# EAGLE design SkyNetV3.1 (EAGLE 7.2.0)

## Sheet 1 of 4: Controller
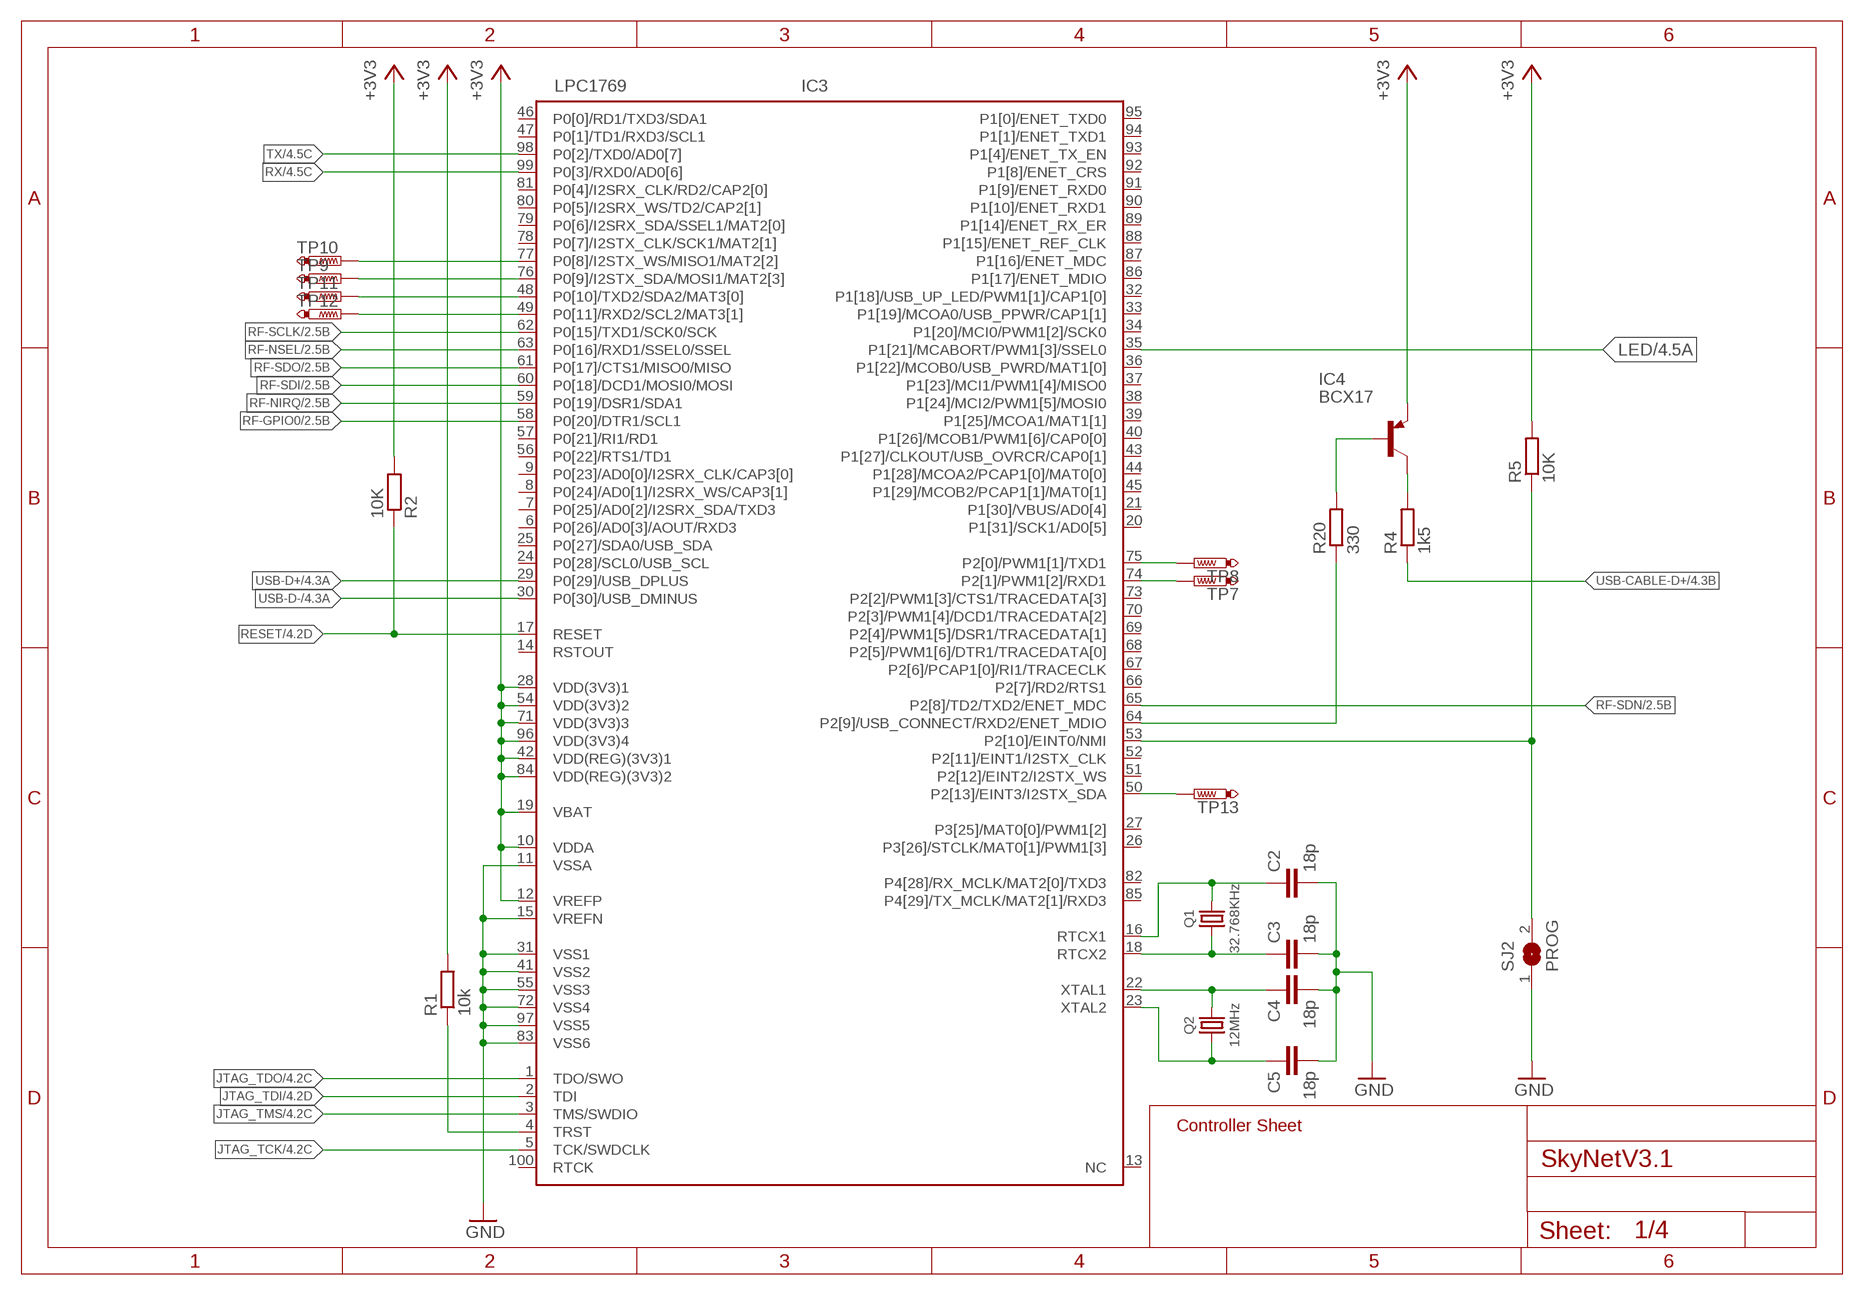
[diagram p0: schematic, sheet 1]

### Parts
C2  18p  C-EUC0603  [C0603]
C3  18p  C-EUC0603  [C0603]
C4  18p  C-EUC0603  [C0603]
C5  18p  C-EUC0603  [C0603]
IC3  LPC1769  LPC1768  [LQFP100-14X14]
IC4  BCX17  [SOT23]
Q1  32.768KHz  XTAL2-PAD  [XTAL_49_18]
Q2  12MHz  XTAL4-PAD  [XTAL_50_32]
R1  10k  R-EU_R0603  [R0603]
R2  10K  R-EU_R0603  [R0603]
R4  1k5  R-EU_R0603  [R0603]
R5  10K  R-EU_R0603  [R0603]
R20  330  R-EU_R0603  [R0603]
SJ2  PROG  SJ  [SJ]
TP7  PTR1B1,27  [B1,27]
TP8  PTR1B1,27  [B1,27]
TP9  PTR1B1,27  [B1,27]
TP10  PTR1B1,27  [B1,27]
TP11  PTR1B1,27  [B1,27]
TP12  PTR1B1,27  [B1,27]
TP13  PTR1B1,27  [B1,27]

### Nets
+3V3: IC3.10(VDDA) IC3.12(VREFP) IC3.19(VBAT) IC3.28(VDD(3V3)1) IC3.42(VDD(REG)(3V3)1) IC3.54(VDD(3V3)2) IC3.71(VDD(3V3)3) IC3.84(VDD(REG)(3V3)2) IC3.96(VDD(3V3)4) IC4.2(E) R1.2 R2.2 R5.2 ; also sheet 2,3,4
GND: C2.2 C3.2 C4.2 C5.2 IC3.11(VSSA) IC3.15(VREFN) IC3.31(VSS1) IC3.41(VSS2) IC3.55(VSS3) IC3.72(VSS4) IC3.83(VSS6) IC3.97(VSS5) SJ2.1 ; also sheet 2,3,4
JTAG-TRST: IC3.4(TRST) R1.1
JTAG_TCK: IC3.5(TCK/SWDCLK) ; also sheet 4
JTAG_TDI: IC3.2(TDI) ; also sheet 4
JTAG_TDO: IC3.1(TDO/SWO) ; also sheet 4
JTAG_TMS: IC3.3(TMS/SWDIO) ; also sheet 4
LED: IC3.35(P1[21]/MCABORT/PWM1[3]/SSEL0) ; also sheet 4
N$3: IC3.75(P2[0]/PWM1[1]/TXD1) TP8.TP
N$5: IC3.76(P0[9]/I2STX_SDA/MOSI1/MAT2[3]) TP9.TP
N$6: IC3.77(P0[8]/I2STX_WS/MISO1/MAT2[2]) TP10.TP
N$7: IC3.74(P2[1]/PWM1[2]/RXD1) TP7.TP
N$8: IC3.49(P0[11]/RXD2/SCL2/MAT3[1]) TP12.TP
N$9: IC3.48(P0[10]/TXD2/SDA2/MAT3[0]) TP11.TP
N$10: IC3.50(P2[13]/EINT3/I2STX_SDA) TP13.TP
PROG: IC3.53(P2[10]/EINT0/NMI) R5.1 SJ2.2
RESET: IC3.17(RESET) R2.1 ; also sheet 4
RF-GPIO0: IC3.58(P0[20]/DTR1/SCL1) ; also sheet 2
RF-NIRQ: IC3.59(P0[19]/DSR1/SDA1) ; also sheet 2
RF-NSEL: IC3.63(P0[16]/RXD1/SSEL0/SSEL) ; also sheet 2
RF-SCLK: IC3.62(P0[15]/TXD1/SCK0/SCK) ; also sheet 2
RF-SDI: IC3.60(P0[18]/DCD1/MOSI0/MOSI) ; also sheet 2
RF-SDN: IC3.65(P2[8]/TD2/TXD2/ENET_MDC) ; also sheet 2
RF-SDO: IC3.61(P0[17]/CTS1/MISO0/MISO) ; also sheet 2
RTCX1: C2.1 IC3.16(RTCX1) Q1.2
RTCX2: C3.1 IC3.18(RTCX2) Q1.1
RX: IC3.99(P0[3]/RXD0/AD0[6]) ; also sheet 4
TX: IC3.98(P0[2]/TXD0/AD0[7]) ; also sheet 4
USB-CABLE-D+: R4.1 ; also sheet 4
USB-CON: IC3.64(P2[9]/USB_CONNECT/RXD2/ENET_MDIO) R20.1
USB-CON-TRANS: IC4.1(B) R20.2
USB-CON-TRANS-2: IC4.3(C) R4.2
USB-D+: IC3.29(P0[29]/USB_DPLUS) ; also sheet 4
USB-D-: IC3.30(P0[30]/USB_DMINUS) ; also sheet 4
XTAL1: C4.1 IC3.22(XTAL1) Q2.3
XTAL2: C5.1 IC3.23(XTAL2) Q2.1
Unconnected: IC3.6(P0[26]/AD0[3]/AOUT/RXD3) IC3.7(P0[25]/AD0[2]/I2SRX_SDA/TXD3) IC3.8(P0[24]/AD0[1]/I2SRX_WS/CAP3[1]) IC3.9(P0[23]/AD0[0]/I2SRX_CLK/CAP3[0]) IC3.13(NC) IC3.14(RSTOUT) IC3.20(P1[31]/SCK1/AD0[5]) IC3.21(P1[30]/VBUS/AD0[4]) IC3.24(P0[28]/SCL0/USB_SCL) IC3.25(P0[27]/SDA0/USB_SDA) IC3.26(P3[26]/STCLK/MAT0[1]/PWM1[3]) IC3.27(P3[25]/MAT0[0]/PWM1[2]) IC3.32(P1[18]/USB_UP_LED/PWM1[1]/CAP1[0]) IC3.33(P1[19]/MCOA0/USB_PPWR/CAP1[1]) IC3.34(P1[20]/MCI0/PWM1[2]/SCK0) IC3.36(P1[22]/MCOB0/USB_PWRD/MAT1[0]) IC3.37(P1[23]/MCI1/PWM1[4]/MISO0) IC3.38(P1[24]/MCI2/PWM1[5]/MOSI0) IC3.39(P1[25]/MCOA1/MAT1[1]) IC3.40(P1[26]/MCOB1/PWM1[6]/CAP0[0]) IC3.43(P1[27]/CLKOUT/USB_OVRCR/CAP0[1]) IC3.44(P1[28]/MCOA2/PCAP1[0]/MAT0[0]) IC3.45(P1[29]/MCOB2/PCAP1[1]/MAT0[1]) IC3.46(P0[0]/RD1/TXD3/SDA1) IC3.47(P0[1]/TD1/RXD3/SCL1) IC3.51(P2[12]/EINT2/I2STX_WS) IC3.52(P2[11]/EINT1/I2STX_CLK) IC3.56(P0[22]/RTS1/TD1) IC3.57(P0[21]/RI1/RD1) IC3.66(P2[7]/RD2/RTS1) IC3.67(P2[6]/PCAP1[0]/RI1/TRACECLK) IC3.68(P2[5]/PWM1[6]/DTR1/TRACEDATA[0]) IC3.69(P2[4]/PWM1[5]/DSR1/TRACEDATA[1]) IC3.70(P2[3]/PWM1[4]/DCD1/TRACEDATA[2]) IC3.73(P2[2]/PWM1[3]/CTS1/TRACEDATA[3]) IC3.78(P0[7]/I2STX_CLK/SCK1/MAT2[1]) IC3.79(P0[6]/I2SRX_SDA/SSEL1/MAT2[0]) IC3.80(P0[5]/I2SRX_WS/TD2/CAP2[1]) IC3.81(P0[4]/I2SRX_CLK/RD2/CAP2[0]) IC3.82(P4[28]/RX_MCLK/MAT2[0]/TXD3) IC3.85(P4[29]/TX_MCLK/MAT2[1]/RXD3) IC3.86(P1[17]/ENET_MDIO) IC3.87(P1[16]/ENET_MDC) IC3.88(P1[15]/ENET_REF_CLK) IC3.89(P1[14]/ENET_RX_ER) IC3.90(P1[10]/ENET_RXD1) IC3.91(P1[9]/ENET_RXD0) IC3.92(P1[8]/ENET_CRS) IC3.93(P1[4]/ENET_TX_EN) IC3.94(P1[1]/ENET_TXD1) IC3.95(P1[0]/ENET_TXD0) IC3.100(RTCK)

### Notes on the sheet
- Controller Sheet

## Sheet 2 of 4: Radio
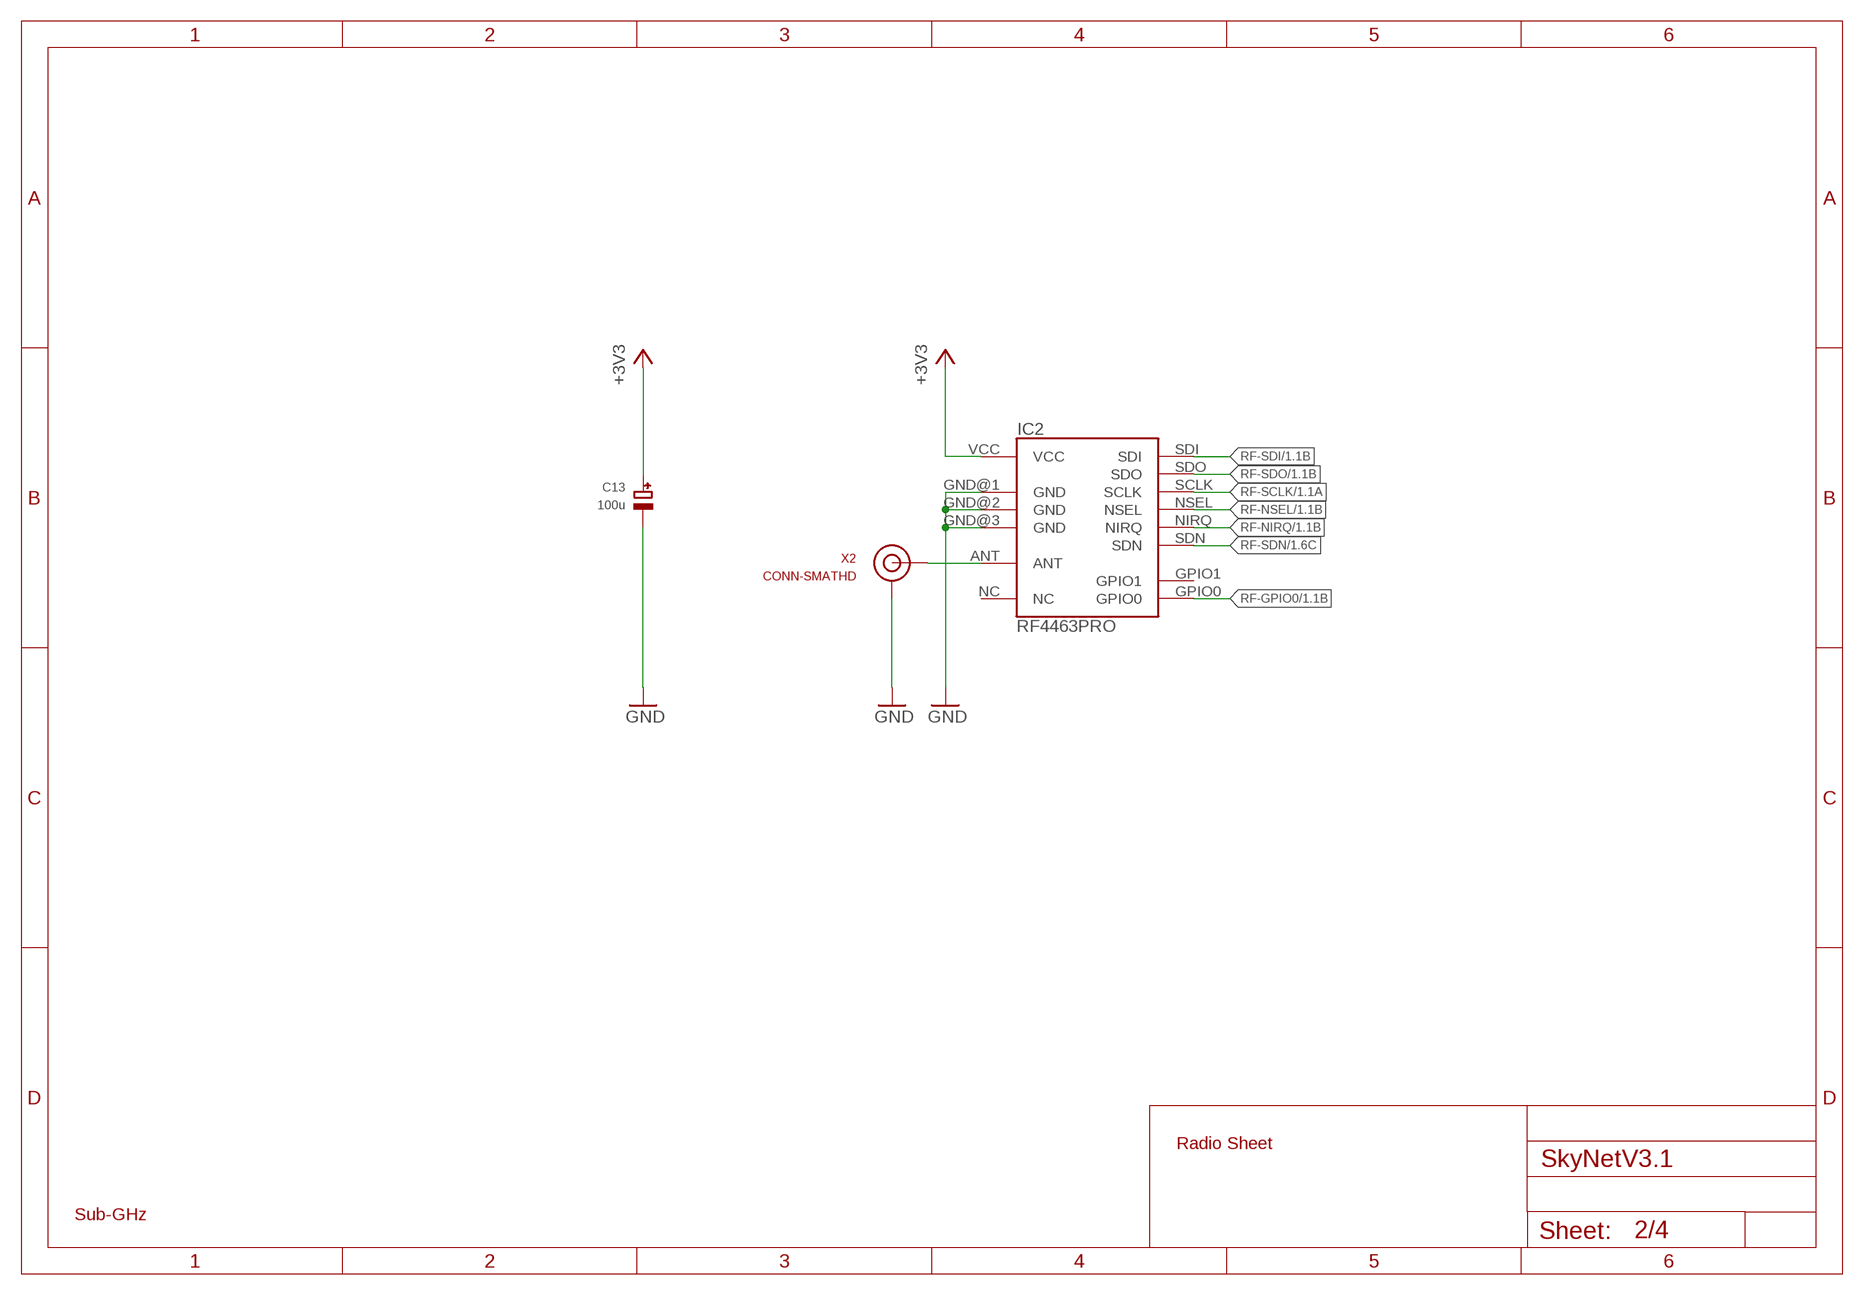
[diagram p1: schematic, sheet 2]

### Parts
C13  100u  CAP_TANTALUMC/6032_WAVE  [EIA6032-28/C-W]
IC2  RF4463PRO  [STD_BOARD]
X2  CONN-SMATHD  [SMA-THD]

### Nets
+3V3: C13.+ IC2.VCC ; also sheet 1,3,4
ANT: IC2.ANT X2.SIG(SIGNAL)
GND: C13.- IC2.GND@1(GND) IC2.GND@2(GND) IC2.GND@3(GND) X2.GND@0(GND) X2.GND@1(GND) X2.GND@2(GND) X2.GND@3(GND) ; also sheet 1,3,4
RF-GPIO0: IC2.GPIO0 ; also sheet 1
RF-NIRQ: IC2.NIRQ ; also sheet 1
RF-NSEL: IC2.NSEL ; also sheet 1
RF-SCLK: IC2.SCLK ; also sheet 1
RF-SDI: IC2.SDI ; also sheet 1
RF-SDN: IC2.SDN ; also sheet 1
RF-SDO: IC2.SDO ; also sheet 1
Unconnected: IC2.GPIO1 IC2.NC

### Notes on the sheet
- Radio Sheet
- Sub-GHz

## Sheet 3 of 4: Power
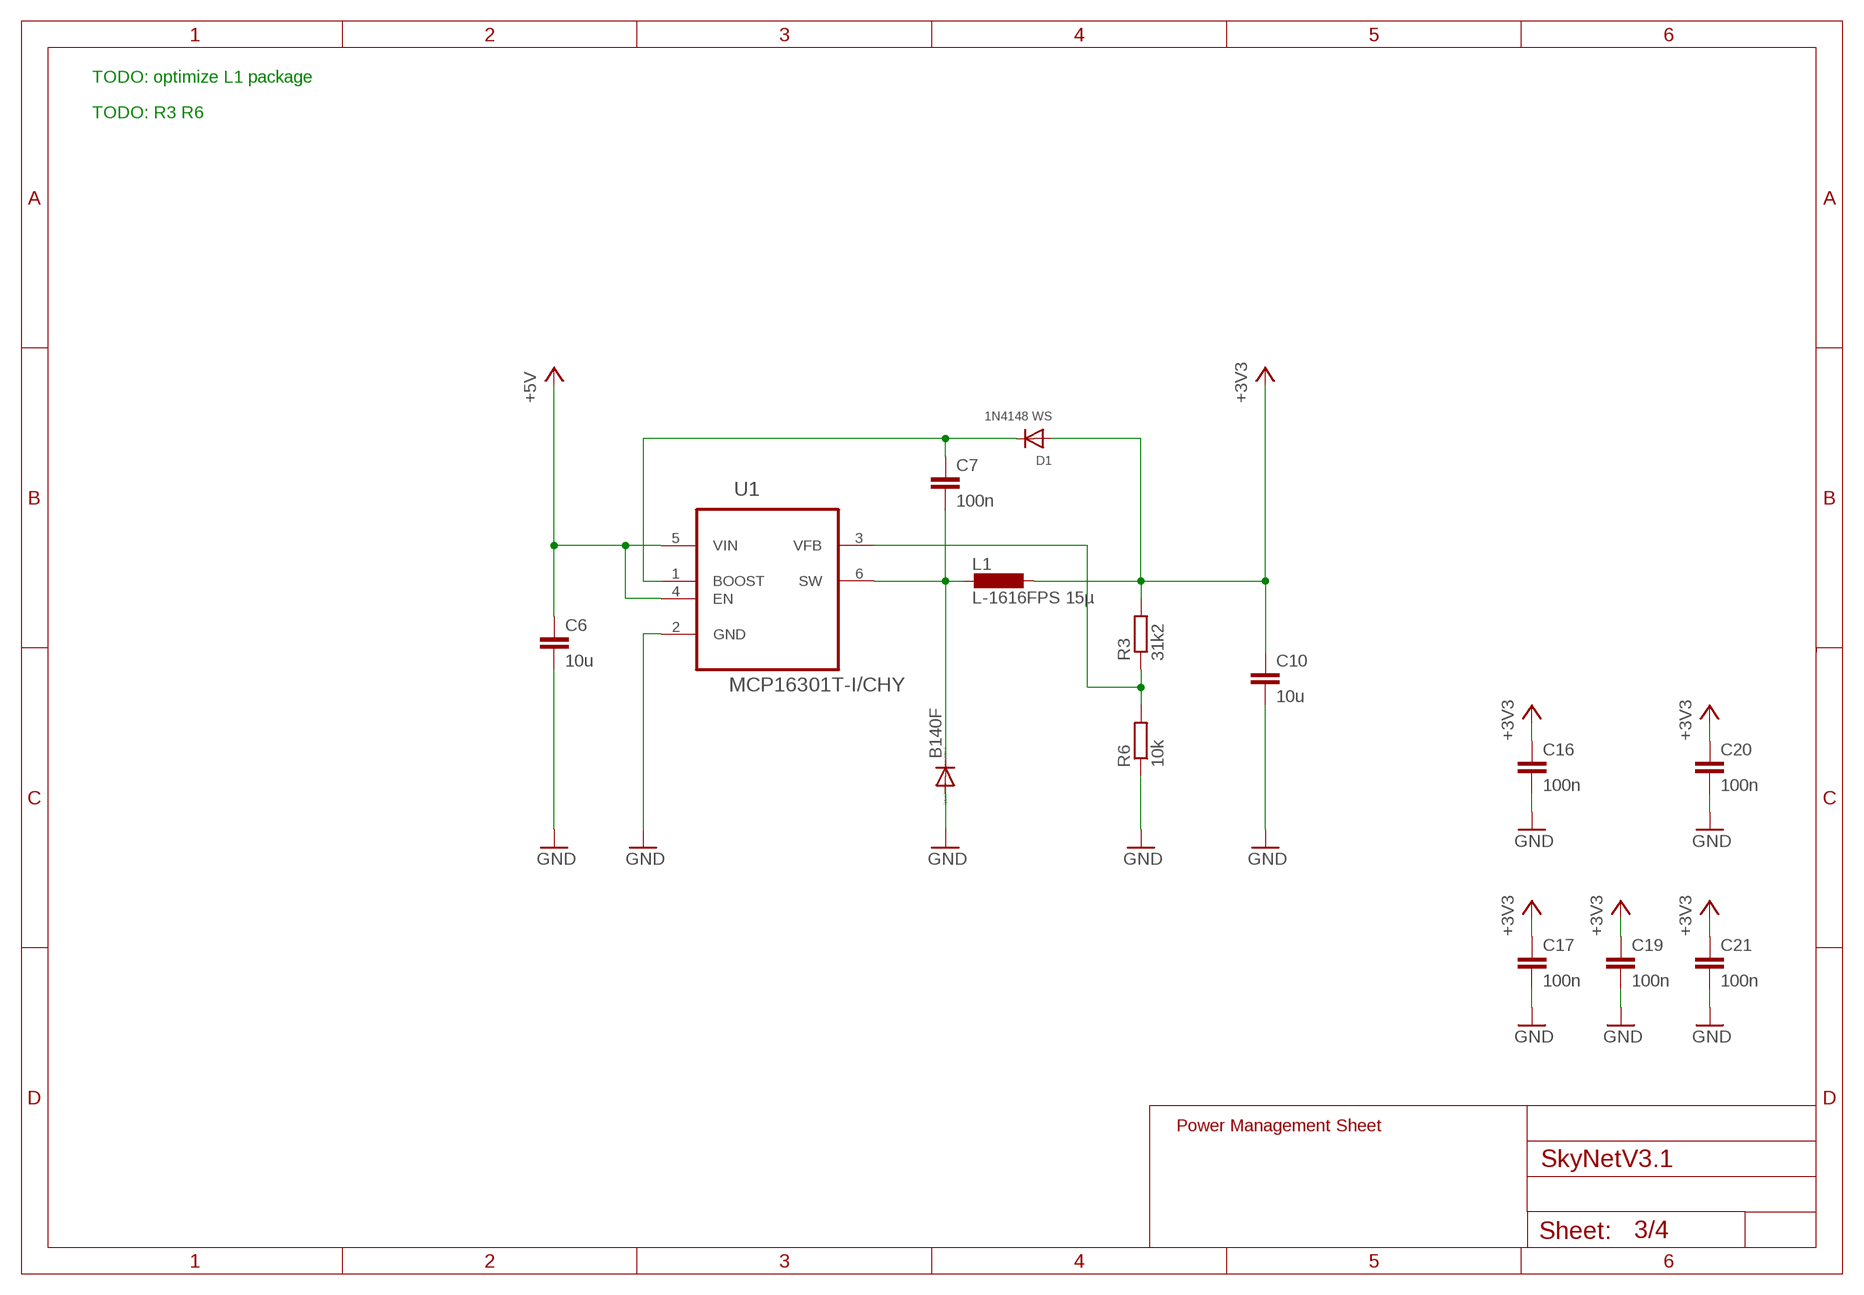
[diagram p2: schematic, sheet 3]

### Parts
B140F  DIODE-DO214AC  [DO214AC]
C6  10u  C-EUC0805  [C0805]
C7  100n  C-EUC0603  [C0603]
C10  10u  C-EUC0805  [C0805]
C16  100n  C-EUC0603  [C0603]
C17  100n  C-EUC0603  [C0603]
C19  100n  C-EUC0603  [C0603]
C20  100n  C-EUC0603  [C0603]
C21  100n  C-EUC0603  [C0603]
D1  1N4148 WS  DIODESOD-323  [SOD-323]
L1  L-1616FPS 15µ  L-EU2220-LQH55D  [LQH55D]
R3  31k2  R-EU_R0603  [R0603]
R6  10k  R-EU_R0603  [R0603]
U1  MCP16301T-I/CHY  [SOT95P290X145-6N]

### Nets
+3V3: C10.1 C16.1 C17.1 C19.1 C20.1 C21.1 D1.A L1.P$1 R3.2 ; also sheet 1,2,4
+5V: C6.1 U1.4(EN) U1.5(VIN) ; also sheet 4
GND: B140F.A C6.2 C10.2 C16.2 C17.2 C19.2 C20.2 C21.2 R6.1 U1.2(GND) ; also sheet 1,2,4
N$1: B140F.C C7.2 L1.P$2 U1.6(SW)
N$2: C7.1 D1.C U1.1(BOOST)
N$4: R3.1 R6.2 U1.3(VFB)

### Notes on the sheet
- TODO: optimize L1 package
- TODO: R3 R6
- Power Management Sheet

## Sheet 4 of 4: Interface
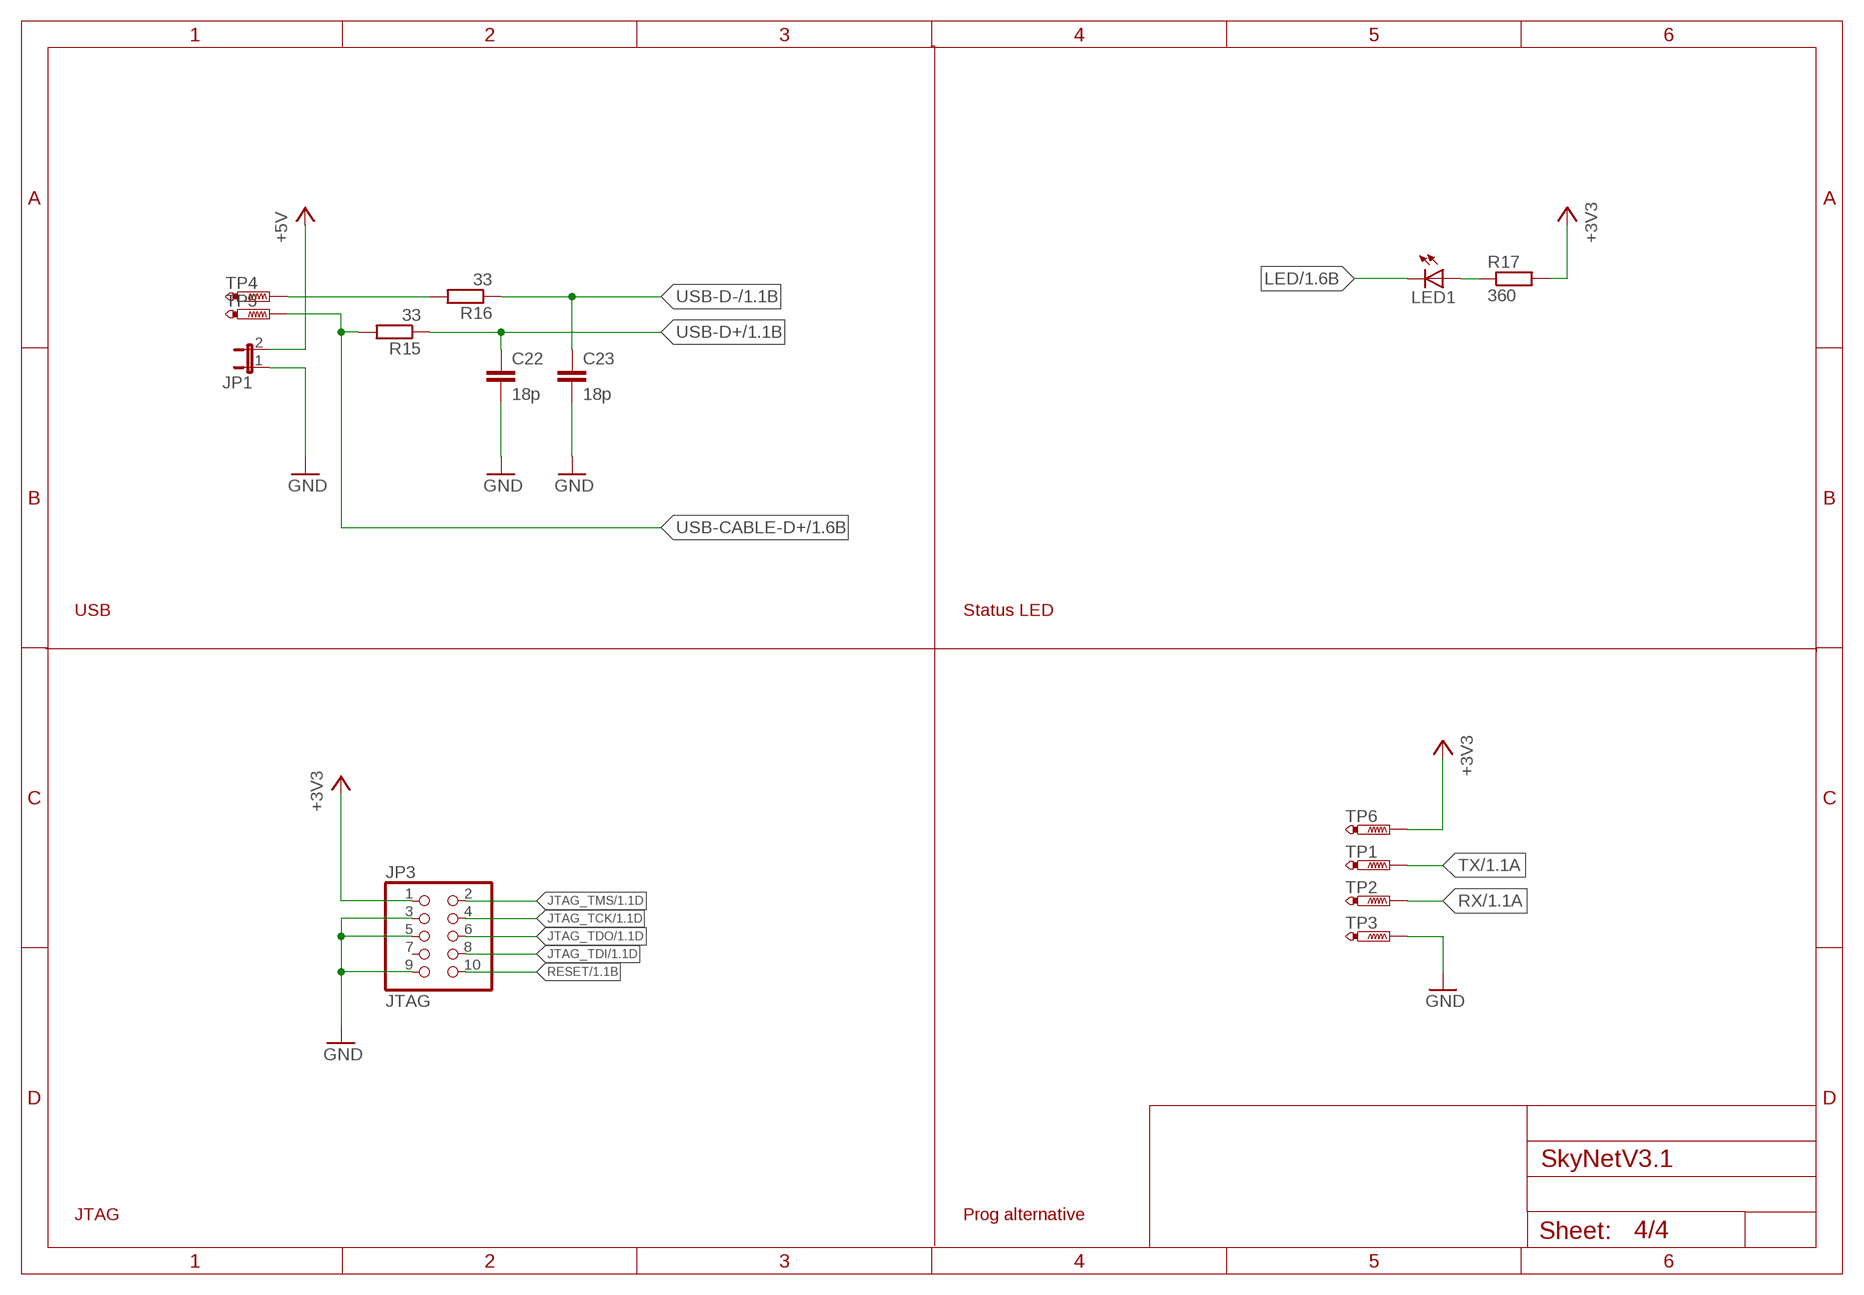
[diagram p3: schematic, sheet 4]

### Parts
C22  18p  C-EUC0603  [C0603]
C23  18p  C-EUC0603  [C0603]
JP1  JP1E  [JP1]
JP3  JTAG  HEADER-2X51.27MM  [2X05_1.27MM_SMT]
LED1  LEDCHIP-LED0805  [CHIP-LED0805]
R15  33  R-EU_R0603  [R0603]
R16  33  R-EU_R0603  [R0603]
R17  360  R-EU_R0603  [R0603]
TP1  PTR1B1,27  [B1,27]
TP2  PTR1B1,27  [B1,27]
TP3  PTR1B2,54  [B2,54]
TP4  PTR1B1,27  [B1,27]
TP5  PTR1B1,27  [B1,27]
TP6  PTR1B2,54  [B2,54]

### Nets
+3V3: JP3.1 R17.2 TP6.TP ; also sheet 1,2,3
+5V: JP1.2 ; also sheet 3
GND: C22.2 C23.2 JP1.1 JP3.3 JP3.5 JP3.9 TP3.TP ; also sheet 1,2,3
JTAG_TCK: JP3.4 ; also sheet 1
JTAG_TDI: JP3.8 ; also sheet 1
JTAG_TDO: JP3.6 ; also sheet 1
JTAG_TMS: JP3.2 ; also sheet 1
LED: LED1.C ; also sheet 1
LED-R-R: LED1.A R17.1
RESET: JP3.10 ; also sheet 1
RX: TP2.TP ; also sheet 1
TX: TP1.TP ; also sheet 1
USB-CABLE-D+: R15.2 TP5.TP ; also sheet 1
USB-CABLE-D-: R16.2 TP4.TP
USB-D+: C22.1 R15.1 ; also sheet 1
USB-D-: C23.1 R16.1 ; also sheet 1
Unconnected: JP3.7

### Notes on the sheet
- USB | Status LED
- JTAG | Prog alternative

## Library data of the parts
B140F = diode:DIODE-: DIODE
C2-C7 C10 C16 C17 C19-C23 = rcl:C-EU: CAPACITOR, European symbol
C13 = microbuilder:CAP_TANTALUM: Tantalum Capacitors Wave footprints have larger pads and are meant to be used for hand soldering. Reflow footprints are optimised for solder paste and a reflow oven. EIA3216-18/A-[R/W] - Size A / 3216-18 / 1206 footprint 4.7µF 25V 10% Tantalum Capacitor 10µF 16V 10% Tantalum Capacitor [Digikey: 495-2236-2-ND] EIA3528-21/B-[R/W] - Size B / 3528-21 47µF 10V 10% Tantalum Capactior [Digikey: 495-2216-1-ND] EIA6032-28/C-[R/W] - Size C / 6032-28 10µF 35V 20% Tantalum Capacitor [Digikey: 495-2285-1-ND] 100µF 16V 10% Tantalum Capactior [Digikey: 399-5214-1-ND]
D1 = microbuilder:DIODE: Diode SMA Model Volts Amps Type Vf Vr Digikey # Notes SSA34-E3 40V 3A Schottky 480mV @ 3A 200uA @ 40V SSA34-E3/61TGITR-ND CDBA120-G 20V 1A Schottky 500mV @ 1A 500uA @ 20V 641-1014-6-ND REEL MBRA210 10V 2A Schottky 350mV @ 2A 700uA @ 10V MBRA210LT3 SOD-123 Model Volts Amps Type Vf Vr Order # Notes BAT54T1G 30V 200mA Schottky 800mV @ 200mA 2uA @ 25V BAT54T1GOSTR-ND B0530W 30V 500mA Schottky 430mV @ 500mA 130uA @ 30V B0530W-FDICT-ND REEL MBR120 1A 20V Schottky 340mV @ 1A MBR120VLSFT1GOSCT-ND SOD-323 Model Volts Amps Type Vf Vr Order # Notes PMEG2005EJ 20V 500mA Schottky 355mV @ 500mA 568-4110-1-ND ZLLS410 10V 570mA Schottky 380mV @ 570mA ZLLS410CT-ND 1N4148WS 75V 150mA Silicon/Simple 1V 1N4148WSFSCT-ND REEL SOD-523 Model Volts Amps Type Vf Vr Order # Notes BAT54XV2 30V 200mA Schottky 0.8V @ 100mA BAT54XV2CT-ND TB751S 30V 30mA Schottky RB751S-40TE61CT-ND SOT23-R/W (R = Solder Paste/Reflow Ovens, W = Hand-Soldering) Model Volts Amps Type Vf Vr Order # Notes BAT54FILM 40V 300mA Schottky 497-7162-1-ND
IC2 = RF4436PRO:RF4463PRO: RF4463PRO module with Si4463 chipset.
IC3 = lpc1xxx-v6:LPC1768: LPC1768 100 MHz 32-bit ARM Cortex-M3 based microcontroller featuring a high level of integration and low power consumption. 512 kB Flash, 64 kB SRAM, USB Device/Host/OTG, 2 CAN, DAC, Ethernet MarcVl - Datasheet available on www.nxp.com
IC4 = skynet_other:BCX17
JP1 = jumper:JP1E: JUMPER
JP3 = microbuilder:HEADER-2X5: PIN HEADER
L1 = jt-inductors:L-EU: Inductor
LED1 = led:LED: LED OSRAM: - CHIPLED LG R971, LG N971, LY N971, LG Q971, LY Q971, LO R971, LY R971 LH N974, LH R974 LS Q976, LO Q976, LY Q976 LO Q996 - Hyper CHIPLED LW Q18S LB Q993, LB Q99A, LB R99A - SideLED LS A670, LO A670, LY A670, LG A670, LP A670 LB A673, LV A673, LT A673, LW A673 LH A674 LY A675 LS A676, LA A676, LO A676, LY A676, LW A676 LS A679, LY A679, LG A679 - Hyper Micro SIDELED® LS Y876, LA Y876, LO Y876, LY Y876 LT Y87S - SmartLED LW L88C, LW L88S LB L89C, LB L89S, LG L890 LS L89K, LO L89K, LY L89K LS L896, LA L896, LO L896, LY L896 - TOPLED LS T670, LO T670, LY T670, LG T670, LP T670 LSG T670, LSP T670, LSY T670, LOP T670, LYG T670 LG T671, LOG T671, LSG T671 LB T673, LV T673, LT T673, LW T673 LH T674 LS T676, LA T676, LO T676, LY T676, LB T676, LH T676, LSB T676, LW T676 LB T67C, LV T67C, LT T67C, LS T67K, LO T67K, LY T67K, LW E67C LS E67B, LA E67B, LO E67B, LY E67B, LB E67C, LV E67C, LT E67C LW T67C LS T679, LY T679, LG T679 LS T770, LO T770, LY T770, LG T770, LP T770 LB T773, LV T773, LT T773, LW T773 LH T774 LS E675, LA E675, LY E675, LS T675 LS T776, LA T776, LO T776, LY T776, LB T776 LHGB T686 LT T68C, LB T68C - Hyper Mini TOPLED® LB M676 - Mini TOPLED Santana® LG M470 LS M47K, LO M47K, LY M47K Source: http://www.osram.convergy.de LUXEON: - LUMILED® LXK2-PW12-R00, LXK2-PW12-S00, LXK2-PW14-U00, LXK2-PW14-V00 LXK2-PM12-R00, LXK2-PM12-S00, LXK2-PM14-U00 LXK2-PE12-Q00, LXK2-PE12-R00, LXK2-PE12-S00, LXK2-PE14-T00, LXK2-PE14-U00 LXK2-PB12-K00, LXK2-PB12-L00, LXK2-PB12-M00, LXK2-PB14-N00, LXK2-PB14-P00, LXK2-PB14-Q00 LXK2-PR12-L00, LXK2-PR12-M00, LXK2-PR14-Q00, LXK2-PR14-R00 LXK2-PD12-Q00, LXK2-PD12-R00, LXK2-PD12-S00 LXK2-PH12-R00, LXK2-PH12-S00 LXK2-PL12-P00, LXK2-PL12-Q00, LXK2-PL12-R00 Source: www.luxeon.com KINGBRIGHT: KA-3528ASYC Source: www.kingbright.com
Q1 Q2 = skynet_other:XTAL
R1-R6 R15-R17 R20 = rcl:R-EU_: RESISTOR, European symbol
SJ2 = jumper:SJ: SMD solder JUMPER
TP1-TP13 = testpad:PTR1: TEST PIN
U1 = skynet_other:MCP16301T-I/CHY: IC, BUCK, ADJ, 0.6A, 6SOT23; MPN: MCP16301T-I/CHY; OC_FARNELL: 2009288; OC_NEWARK: 58T3650; PACKAGE: SOT23-6; SUPPLIER: Microchip
X2 = SteveMarple:CONN-SMA: SMA connector

## Board
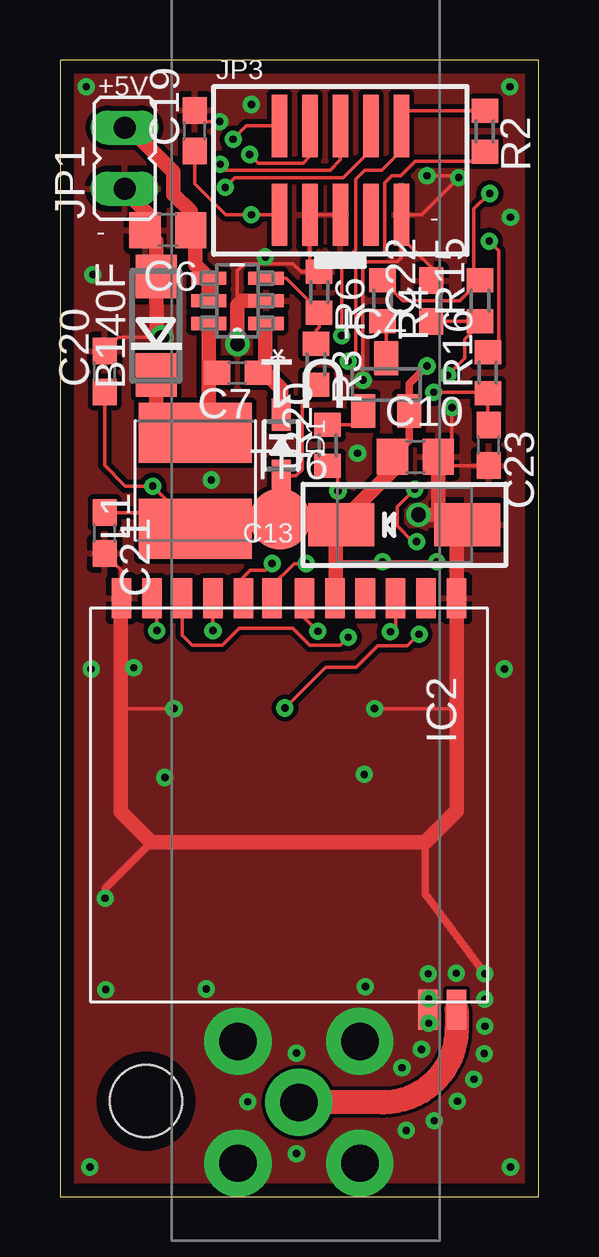
[diagram p4: board, top side]
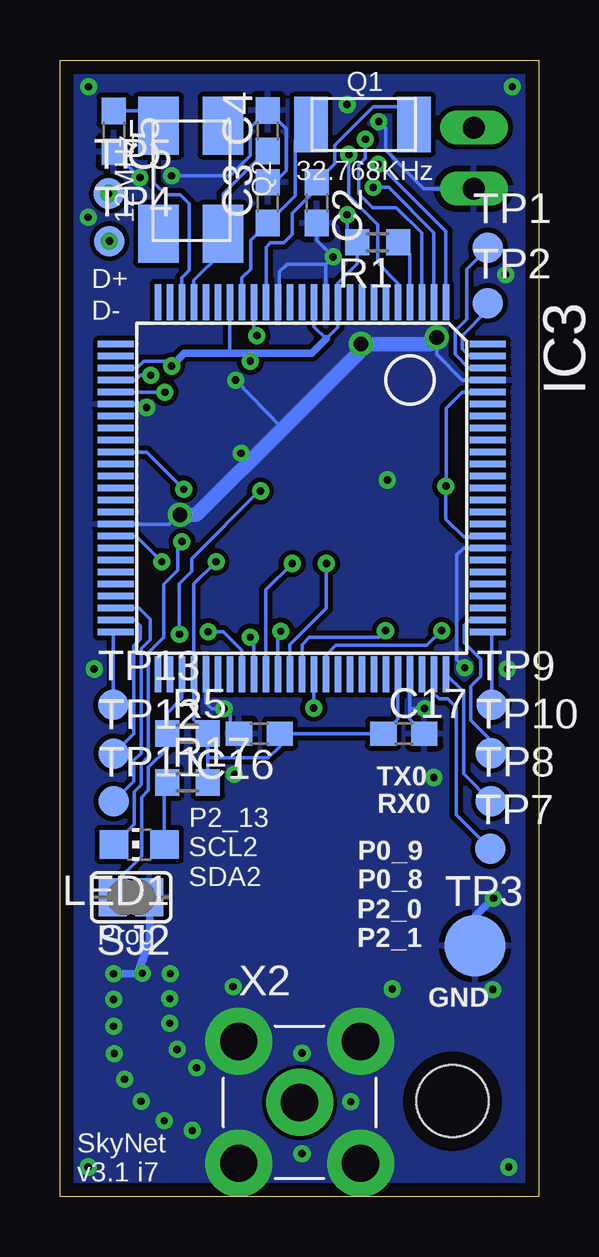
[diagram p5: board, bottom side, seen from below]

Size 19.94 x 47.37 mm. Coordinates in mm from the lower left corner, seen from the top.
Outline: 0,47.37 0,0 19.94,0 19.94,47.37 0,47.37
Copper layers (1*16): Top 0.035mm / dielectric 1.5mm / Bottom 0.035mm
Design rules "default *": minimum track width 6mil, minimum drill 12mil, track to track 6mil, track to pad 6mil, pad to pad 6mil, via to via 6mil, smd to smd 6mil, copper to edge 22mil, drill to drill 24mil, minimum pad ring 10mil, minimum via ring 8mil, stop-mask expansion 4mil, vias tented up to drill 24mil, thermal gap 10mil
Holes 3 mm at 3.58,3.99

### Footprints (pad centres in the part's own frame; a part is rotated, then mirrored left to right if it is on the bottom)
DO214AC = smd 1.8 x 1.7: A 2.05,0; C -2.05,0
C0603 = smd 1.1 x 1: 1 -0.85,0; 2 0.85,0
C0805 = smd 1.3 x 1.5: 1 -0.95,0; 2 0.95,0
EIA6032-28/C-W = smd 2.75 x 1.8: + 2.625,0; - -2.625,0
SOD-323 = smd 1.35 x 0.8: A 1.27,0; C -1.27,0
STD_BOARD = smd 1.676 x 0.813: ANT 8.811,6.35; GND@1 8.811,5.159; GND@2 -8.334,6.35; GND@3 -8.334,-7.62; GPIO0 -8.334,3.81; GPIO1 -8.334,2.54; NC -8.334,5.08; NIRQ -8.334,-5.08; NSEL -8.334,-3.81; SCLK -8.334,-2.54; SDI -8.334,-1.349; SDN -8.334,-6.35; SDO -8.334,0; VCC -8.334,1.27
LQFP100-14X14 = smd 0.27 x 1.5: 1 -6,-7.75; 2 -5.5,-7.75; 3 -5,-7.75; 4 -4.5,-7.75; 5 -4,-7.75; 6 -3.5,-7.75; 7 -3,-7.75; 8 -2.5,-7.75; 9 -2,-7.75; 10 -1.5,-7.75; 11 -1,-7.75; 12 -0.5,-7.75; 13 0,-7.75; 14 0.5,-7.75; 15 1,-7.75; 16 1.5,-7.75; 17 2,-7.75; 18 2.5,-7.75; 19 3,-7.75; 20 3.5,-7.75; 21 4,-7.75; 22 4.5,-7.75; 23 5,-7.75; 24 5.5,-7.75; 25 6,-7.75; 51 6,7.75; 52 5.5,7.75; 53 5,7.75; 54 4.5,7.75; 55 4,7.75; 56 3.5,7.75; 57 3,7.75; 58 2.5,7.75; 59 2,7.75; 60 1.5,7.75; 61 1,7.75; 62 0.5,7.75; 63 0,7.75; 64 -0.5,7.75; 65 -1,7.75; 66 -1.5,7.75; 67 -2,7.75; 68 -2.5,7.75; 69 -3,7.75; 70 -3.5,7.75; 71 -4,7.75; 72 -4.5,7.75; 73 -5,7.75; 74 -5.5,7.75; 75 -6,7.75 | smd 1.5 x 0.27: 26 7.75,-6; 27 7.75,-5.5; 28 7.75,-5; 29 7.75,-4.5; 30 7.75,-4; 31 7.75,-3.5; 32 7.75,-3; 33 7.75,-2.5; 34 7.75,-2; 35 7.75,-1.5; 36 7.75,-1; 37 7.75,-0.5; 38 7.75,0; 39 7.75,0.5; 40 7.75,1; 41 7.75,1.5; 42 7.75,2; 43 7.75,2.5; 44 7.75,3; 45 7.75,3.5; 46 7.75,4; 47 7.75,4.5; 48 7.75,5; 49 7.75,5.5; 50 7.75,6; 76 -7.75,6; 77 -7.75,5.5; 78 -7.75,5; 79 -7.75,4.5; 80 -7.75,4; 81 -7.75,3.5; 82 -7.75,3; 83 -7.75,2.5; 84 -7.75,2; 85 -7.75,1.5; 86 -7.75,1; 87 -7.75,0.5; 88 -7.75,0; 89 -7.75,-0.5; 90 -7.75,-1; 91 -7.75,-1.5; 92 -7.75,-2; 93 -7.75,-2.5; 94 -7.75,-3; 95 -7.75,-3.5; 96 -7.75,-4; 97 -7.75,-4.5; 98 -7.75,-5; 99 -7.75,-5.5; 100 -7.75,-6
SOT23 = smd 1 x 1.4: 1 -0.95,-1.1; 2 0.95,-1.1; 3 0,1.1
JP1 = drill 0.914 long: 1 0,-1.27; 2 0,1.27
2X05_1.27MM_SMT = smd 0.65 x 2.6: 1 -2.54,-1.85; 2 -2.54,1.85; 3 -1.27,-1.85; 4 -1.27,1.85; 5 0,-1.85; 6 0,1.85; 7 1.27,-1.85; 8 1.27,1.85; 9 2.54,-1.85; 10 2.54,1.85
LQH55D = smd 2.5 x 4.7: P$1 -2,0; P$2 2,0
CHIP-LED0805 = smd 1.2 x 1.2: A 0,-1.05; C 0,1.05
XTAL_49_18 = smd 1.4 x 2.3: 1 -2.25,0.1; 2 2.05,0.1
XTAL_50_32 = smd 2.4 x 1.7: 1 -2.248,-1.5; 2 2.252,-1.5; 3 2.252,1.19; 4 -2.248,1.19
R0603 = smd 1 x 1.1: 1 -0.85,0; 2 0.85,0
SJ = smd 1.168 x 1.6: 1 -0.762,0; 2 0.762,0
B1,27 = smd 1.27 x 1.27: TP 0,0
B2,54 = smd 2.54 x 2.54: TP 0,0
SOT95P290X145-6N = smd 1.473 x 0.559: 1 -1.194,0.94; 2 -1.194,0; 3 -1.194,-0.94; 4 1.194,-0.94; 5 1.194,0; 6 1.194,0.94
SMA-THD = drill 1.549 pad 2.794: GND@0 -2.54,2.54; GND@1 2.54,2.54; GND@2 2.54,-2.54; GND@3 -2.54,-2.54; SIG 0,0

### Placement (x,y rotation side)
B140F  4.01,36.3 90 top
C2  9.25,41.43 270 bottom
C3  11.28,41.43 90 bottom
C4  11.28,44.42 90 bottom
C5  17.7,44.4 270 bottom
C6  4.5,40.28 180 top
C7  7.39,34.34 180 top
C10  14.81,30.84 0 top
C13  14.35,28 180 top
C16  11.63,19.3 180 bottom
C17  5.61,19.3 0 bottom
C19  5.61,44.42 90 top
C20  1.85,34.39 90 top
C21  1.85,27.66 270 top
C22  15.46,37.33 90 top
C23  17.86,31.32 270 top
D1  9.22,31.32 270 top
IC2  10.18,16.61 270 top
IC3  9.86,29.53 180 bottom
IC4  13.6,33.85 0 top
JP1  2.69,43.28 0 top
JP3  11.68,42.77 0 top
L1  5.64,29.84 90 top
LED1  16.64,14.68 90 bottom
Q1  7.24,44.59 0 bottom
Q2  14.33,42.38 270 bottom
R1  6.71,39.78 180 bottom
R2  17.7,44.4 270 top
R3  10.67,34.7 270 top
R4  13.44,37.34 270 top
R5  14.63,19.3 0 bottom
R6  10.8,37.69 270 top
R15  17.5,37.34 90 top
R16  17.83,34.34 90 top
R17  14.63,17.27 0 bottom
R20  11.15,31.32 90 top
SJ2  16.97,12.49 180 bottom
TP1  2.11,39.55 0 bottom
TP2  2.11,37.24 0 bottom
TP3  2.64,10.46 0 bottom
TP4  17.88,39.83 0 bottom
TP5  17.91,41.81 0 bottom
TP6  9.17,28.24 0 top
TP7  2.01,14.5 0 bottom
TP8  1.98,16.48 0 bottom
TP9  1.96,20.5 0 bottom
TP10  1.98,18.49 0 bottom
TP11  17.7,16.48 0 bottom
TP12  17.7,18.47 0 bottom
TP13  17.73,20.5 0 bottom
U1  7.39,37.34 180 top
X2  9.96,3.94 0 bottom

### Tracks (layer width: path | path; a pad name or v marks a point on that pad's centre or on a via)
+3V3  (via drill 0.3)
  Top 0.152: 10.8,28.7 C13.+ | 11.5,26.44 11.52,26.47 v13.44,26.47 v15.7,26.47 | C21.1 5.05,28.51 L1.P$1 5.72,27.76 v3.86,29.62 2.72,29.62 1.85,30.48 C20.1 | R3.2 10.08,33.14 10.08,30.3 9.83,30.05 D1.A | R2.2 17.31,43.15 14.81,43.15 14.2,42.55 13.82,42.55 13.54,42.27 13.54,39.4 13.41,39.27 12.6,39.27 12.32,38.99 12.32,35.13 v12.01,34.82 | C19.1 5.61,42.21 6.9,40.92 | 6.9,40.92 JP3.1 | 6.9,40.92 6.91,40.92 v7.98,40.92
  Top 0.203: TP6.TP 9.22,28.24
  Top 0.305: C10.1 14.55,31.52 IC4.2 14.55,33.87 v15.29,34.62
  Top 0.61: L1.P$1 5.72,28 9.22,28 | 9.22,28 C13.+ | D1.A 9.22,28.24 9.22,28 | C13.+ 11.63,27.91 11.5,27.78 11.5,26.44 11.5,24.99 IC2.VCC | C10.1 13.88,30.39 13.88,30.29 11.74,28.14 C13.+
  Bottom 0.152: 13.49,18.87 13.49,19.01 R5.2 | IC3.71 5.86,19.91 C17.1 C16.1 10.78,18.76 11.25,18.29 13.78,18.29 | v13.44,26.47 14.36,25.54 IC3.54 14.36,19.88 R5.2 | IC3.84 2.13,27.51 3.12,27.51 3.86,28.24 v3.86,29.62 3.84,29.64 3.84,32.87 3.17,33.53 IC3.96 | IC3.28 16.75,34.53 16.46,34.82 15.49,34.82 v15.29,34.62 | IC3.42 16.76,27.53 v15.7,26.47 | IC3.12 9.36,36.26 8.85,35.75 8.36,36.24 IC3.10 8.36,38.07 7.56,38.88 R1.2 7.98,40.2 v7.98,40.92 | IC3.19 12.86,35.2 12.85,35.15 | v12.01,34.82 12.01,35.15 | R17.2 13.78,18.29 | 13.78,18.29 R5.2
  Bottom 0.305: 8.85,35.75 9.45,35.15 12.01,35.15 12.85,35.15 14.76,35.15 v15.29,34.62
+5V
  Top 0.61: U1.5 U1.4 5.64,38.84 5.64,39.62 5.45,39.82 C6.1 5.45,41.06 4.72,41.78 4.72,42.72 2.9,44.55 JP1.2
ANT
  Top 0.991: IC2.ANT 16.53,7 arc-90 13.46,3.94 X2.SIG
GND  (via drill 0.3, 0.61)
  Top 0.152: 8.84,38.89 9.7,38.89 10.05,38.54 R6.1 10.41,38.92 JP3.3 JP3.5 | 8.84,38.89 7.7,38.89 7.39,38.58 7.39,37.54 7.59,37.34 | v13.11,20.35 16.45,20.35 16.53,20.42 | 2.54,19.3 2.54,18.95 | IC2.GND@3 2.56,26.11 C21.2 | C20.2 2.43,35.81 v4.24,35.81 | C23.2 16.13,30.47 C10.2 16.33,31.41 v16.33,32.89 | v8.56,39.17 8.84,38.89 | JP3.9 14.22,39.98 15.47,38.74 C22.2 | JP3.9 14.22,39.14 14.05,38.96 12.8,38.96 12.62,38.79 v12.62,34.04 | JP3.9 15.07,40.92 v16.61,42.47 16.54,42.55 v15.29,42.55 | C19.2 6.08,44.81 v6.66,44.81 | v3.07,22.05 2.54,22.05 | v4.75,20.35 2.59,20.35 2.54,20.29
  Top 0.305: v1.88,12.45 1.88,12.85 3.81,14.78 | 15.21,14.78 15.21,12.62 v17.7,9.3
  Top 0.61: U1.2 7.59,37.34 7.39,37.13 v7.39,35.53 | v4.24,35.81 4.04,36.04 B140F.A 4.01,39.81 C6.2 3.83,40.79 2.69,41.93 JP1.1 | C13.- 16.53,27.78 IC2.GND@2 16.53,20.42 16.53,16.1 15.21,14.78 3.81,14.78 2.54,16.05 2.54,18.95 2.54,20.29 2.54,22.05 2.54,24.92 IC2.GND@3 | C13.- 16.73,28.02 16.23,28.02 15.76,28.49 C10.2 | C13.- 16.84,28.14 16.52,28.46 16.49,28.42 v14.94,28.42
  Bottom 0.152: C16.2 12.84,19.66 12.84,20.08 v13.11,20.35 13.61,20.35 13.86,20.59 IC3.55 | IC3.72 5.36,20.35 | 5.36,20.35 5.36,19.9 C17.2 | IC3.83 3.12,27.03 3.4,26.75 3.4,22.38 v3.07,22.05 | IC3.97 3.17,34.03 4.24,35.1 v4.24,35.81 | IC3.41 15.38,28.03 14.99,28.42 v14.94,28.42 | IC3.31 16.47,33.03 v16.33,32.89 | C3.2 10.96,42.3 10.52,42.75 10.52,44.51 C4.2 12.01,44.54 12.01,43.38 12.85,42.55 v15.29,42.55 | IC3.11 8.86,38.86 | 8.86,38.86 8.86,38.87 v8.56,39.17 9.25,39.85 C2.2 | IC3.15 10.8,37.35 R6.1 10.48,38.86 8.86,38.86 | v16.61,42.47 16.62,42.47 C5.2 | v12.62,34.04 10.73,32.09 10.58,32.09 | v6.66,44.81 6.38,44.53 6.38,43.61 4.78,42.01 JP1.1 | v4.75,20.35 5.36,20.35
  Bottom 0.305: TP3.TP 2.64,11.68 v1.88,12.45 | v17.7,9.3 16.71,9.3 16.21,10.64 SJ2.1
  Bottom 0.61: v4.24,35.81 4.52,35.53 v7.39,35.53 7.49,35.18 10.58,32.09 14.22,28.47 14.28,28.42 v14.94,28.42
  other vias: 1.37,38.43 7.98,45.52 18.77,40.82 18.52,22 12.67,17.6 4.37,17.48 1.91,8.64 6.1,8.66 12.73,8.76 1.24,1.24 18.77,1.24 14.25,5.38 15.06,6.15 15.37,7.24 15.37,8.26 17.7,8.23 17.7,7.11 17.68,5.97 17.25,4.9 16.56,3.99 15.6,3.17 14.43,2.77 1.3,22 16.51,9.32 15.34,9.3 7.82,3.96 9.86,1.8 9.86,5.99 1.09,46.25 18.75,46.25 6.3,29.87 12.4,30.99
  pour Top (isolate 0.152, no thermals): 5.66,0.15 18.67,0.15 18.67,9.55 5.66,9.55
  pour Bottom (isolate 0.152, no thermals): 5.71,0.15 18.67,0.15 18.67,8.53 5.71,8.53
  pour Top (isolate 0.203): 0.08,47.4 0.08,0.15 20.4,0.15 20.4,47.4
  pour Bottom (isolate 0.203): 0.08,47.14 0.08,0.15 20.14,0.15 20.14,47.14
JTAG-TRST
  Bottom 0.152: IC3.4 5.36,39.28 R1.1
JTAG_TCK  (via drill 0.3)
  Top 0.152: JP3.4 10.41,43.36 10.13,43.08 8.26,43.08 v7.9,43.43
  Bottom 0.152: IC3.5 5.86,38.07 6.71,38.91 6.71,40.51 7.9,41.71 v7.9,43.43
JTAG_TDI  (via drill 0.3)
  Top 0.152: JP3.8 12.95,43.61 11.81,42.47 7.29,42.47 v6.88,42.06
  Bottom 0.152: IC3.2 4.36,40.17 6.25,42.06 v6.88,42.06
JTAG_TDO  (via drill 0.3)
  Top 0.152: JP3.6 11.68,43.21 11.25,42.77 6.93,42.77 v6.68,43.03
  Bottom 0.152: IC3.1 3.86,40.23 6.66,43.03 v6.68,43.03
JTAG_TMS  (via drill 0.3)
  Top 0.152: v7.21,44.07 7.77,44.62 JP3.2
  Bottom 0.152: IC3.3 4.86,40.16 5.92,41.22 6.91,41.22 7.49,41.81 7.49,43 7.21,43.28 v7.21,44.07
LED  (via drill 0.3)
  Top 0.152: v14.78,29.49 14.05,28.75 14.05,27.97 14.71,27.31 v14.86,27.31
  Bottom 0.152: IC3.35 16.32,31.03 v14.78,29.49 | 17.69,15.08 LED1.C 16.84,15.53 16.84,16.89 16.56,17.17 16.56,18.03 16.26,18.34 16.26,22.68 15.62,23.32 15.62,25.53 15.04,26.11 15.04,27.13 v14.86,27.31
LED-R-R
  Bottom 0.152: R17.1 15.59,17.17 LED1.A
N$1
  Top 0.61: 5.93,32.06 L1.P$2 | B140F.C 4.01,31.85 L1.P$2 | U1.6 6.2,34.72 6.2,34.45 | 6.2,34.45 C7.2 | L1.P$2 6.2,32.4 6.2,34.45
N$2
  Top 0.61: D1.C 9.22,33.68 8.56,34.34 | 8.56,34.34 8.56,36.37 U1.1 | C7.1 8.56,34.34
N$3
  Bottom 0.152: IC3.75 3.12,21.05 3.12,17.63 TP8.TP
N$4
  Top 0.152: R3.1 10.67,36.12 10.8,36.25 R6.2 10.73,36.97 9.42,38.28 U1.3
N$5
  Bottom 0.152: IC3.76 1.96,23.38 TP9.TP
N$6
  Bottom 0.152: IC3.77 2.89,24.03 3.1,23.83 3.1,23.09 2.41,22.4 2.41,21.69 2.82,21.29 2.82,19.86 1.98,19.02 TP10.TP
N$7
  Bottom 0.152: IC3.74 4.36,20.97 4.14,20.75 3.78,20.75 3.43,20.4 3.43,15.93 TP7.TP
N$8
  Bottom 0.152: IC3.49 16.82,24.03 16.59,23.8 16.59,23.24 16.87,22.96 16.87,19.3 TP12.TP
N$9
  Bottom 0.152: IC3.48 16.63,24.53 16.18,24.08 16.18,23.22 16.56,22.83 16.56,18.49 16.87,18.19 16.87,17.32 TP11.TP
N$10
  Bottom 0.152: IC3.50 17.73,23.41 TP13.TP
PROG
  Bottom 0.152: IC3.53 14.86,20.78 15.48,20.16 R5.1 | 15.47,19.32 R5.1 | R5.1 15.48,18.68 16.26,17.91 16.26,16.94 16.54,16.66 16.54,14.2 17.74,13 SJ2.2
RESET  (via drill 0.3)
  Top 0.152: v11.74,35.89 11.74,38.89 12.32,39.47 12.32,42.39 12.7,42.77 13.41,42.77 14.22,43.59 JP3.10 14.22,45.25 R2.1
  Bottom 0.152: IC3.17 11.86,36.02 v11.74,35.89
RF-GPIO0  (via drill 0.3)
  Top 0.152: v13.77,23.55 13.99,23.77 IC2.GPIO0
  Bottom 0.152: IC3.58 12.36,22.77 13.13,23.55 v13.77,23.55
RF-NIRQ  (via drill 0.3)
  Top 0.152: v12.01,23.32 11.68,22.99 10.41,22.99 9.7,23.7 7.47,23.7 6.76,22.99 5.51,22.99 5.1,23.4 IC2.NIRQ
  Bottom 0.152: v12.01,23.32 11.86,23.16 IC3.59
RF-NSEL  (via drill 0.3)
  Top 0.152: IC2.NSEL 6.37,23.6 v6.38,23.6
  Bottom 0.152: v6.38,23.6 6.66,23.32 9.55,23.32 9.86,23.01 IC3.63
RF-SCLK  (via drill 0.3)
  Top 0.152: IC2.SCLK 7.64,25.83 7.93,26.11 8.56,26.11 v8.84,26.39
  Bottom 0.152: IC3.62 10.36,23.02 8.84,24.54 v8.84,26.39
RF-SDI  (via drill 0.3)
  Top 0.152: IC2.SDI 8.79,24.9 8.79,25.43 9.75,26.39 v10.26,26.39
  Bottom 0.152: IC3.60 11.36,25.29 v10.26,26.39
RF-SDN  (via drill 0.3)
  Top 0.152: IC2.SDN 4.04,24.73 v4.04,23.6
  Bottom 0.152: v4.04,23.6 4.65,22.99 8.46,22.99 8.86,22.56 IC3.65
RF-SDO  (via drill 0.3)
  Top 0.152: IC2.SDO 10.18,24.14 v10.74,23.57
  Bottom 0.152: IC3.61 10.86,23.46 v10.74,23.57
RTCX1
  Bottom 0.152: IC3.16 11.35,39.57 11.18,39.75 10.62,39.75 10.26,40.11 10.26,41 9.25,42.01 C2.1 8.48,43.04 8.48,43.82 6.88,45.42 5.56,45.42 5.19,45.04 Q1.2
RTCX2
  Bottom 0.152: Q1.1 10.13,44.04 10.13,41.72 C3.1 11.99,39.87 11.99,38.66 12.36,38.29 IC3.18
RX
  Bottom 0.152: IC3.99 2.88,35.03 3.18,35.33 3.18,35.89 2.11,36.96 TP2.TP
TX
  Bottom 0.152: IC3.98 2.91,34.53 3.48,35.1 3.48,36.09 3,36.58 3,38.66 TP1.TP
USB-CABLE-D+  (via drill 0.3)
  Top 0.152: TP5.TP 17.88,41.81 17.25,41.17 17.25,38.44 R15.2 16.65,37.34 14.29,37.34 R4.1
  other vias: 17.91,41.81
USB-CABLE-D-  (via drill 0.3)
  Top 0.152: TP4.TP 18.29,39.42 18.29,35.65 R16.2
  other vias: 17.88,39.83
USB-CON  (via drill 0.3)
  Top 0.152: v11.58,29.41 11.58,29.96 R20.1 | v9.37,20.37 11.07,22.07 12.34,22.07 13.23,22.96 14.48,22.96 v14.96,23.44
  Bottom 0.152: IC3.64 9.37,21.77 v9.37,20.37 | v11.58,29.41 11.63,29.41 14.45,26.59 14.45,26.06 14.96,25.55 v14.96,23.44
USB-CON-TRANS
  Top 0.152: R20.2 12.25,32.17 IC4.1
USB-CON-TRANS-2
  Top 0.152: R4.2 13.6,36.33 IC4.3
USB-D+  (via drill 0.3)
  Top 0.152: v16.15,34.24 16.87,34.95 16.87,35.74 17.5,36.37 R15.1 C22.1
  Bottom 0.152: IC3.29 16.79,34.03 16.59,34.24 v16.15,34.24
USB-D-  (via drill 0.3)
  Top 0.152: v15.57,33.53 17.79,33.53 R16.1 17.83,32.19 C23.1
  Bottom 0.152: IC3.30 16.39,33.53 v15.57,33.53
XTAL1
  Bottom 0.152: IC3.22 14.36,38.19 13.21,39.34 13.21,40.06 Q2.3 13.14,41.8 11.59,43.35 C4.1
XTAL2
  Bottom 0.152: IC3.23 14.86,38.3 14.55,38.61 14.55,41.38 14.94,41.76 15.52,41.76 16,42.24 16,43.69 15.83,43.86 Q2.1 16.45,45.25 C5.1

### Text on the board
t_silk: +5V | - | -
b_silk: D+ | D- | TX0 | RX0 | P2_13 | P0_9 | SCL2 | P0_8 | SDA2 | P2_0 | P2_1 | Prog | GND | SkyNet / v3.1 i7